# Altium schematic sheet P[06]_LPDDR4.SchDoc
size 513 x 386 mm
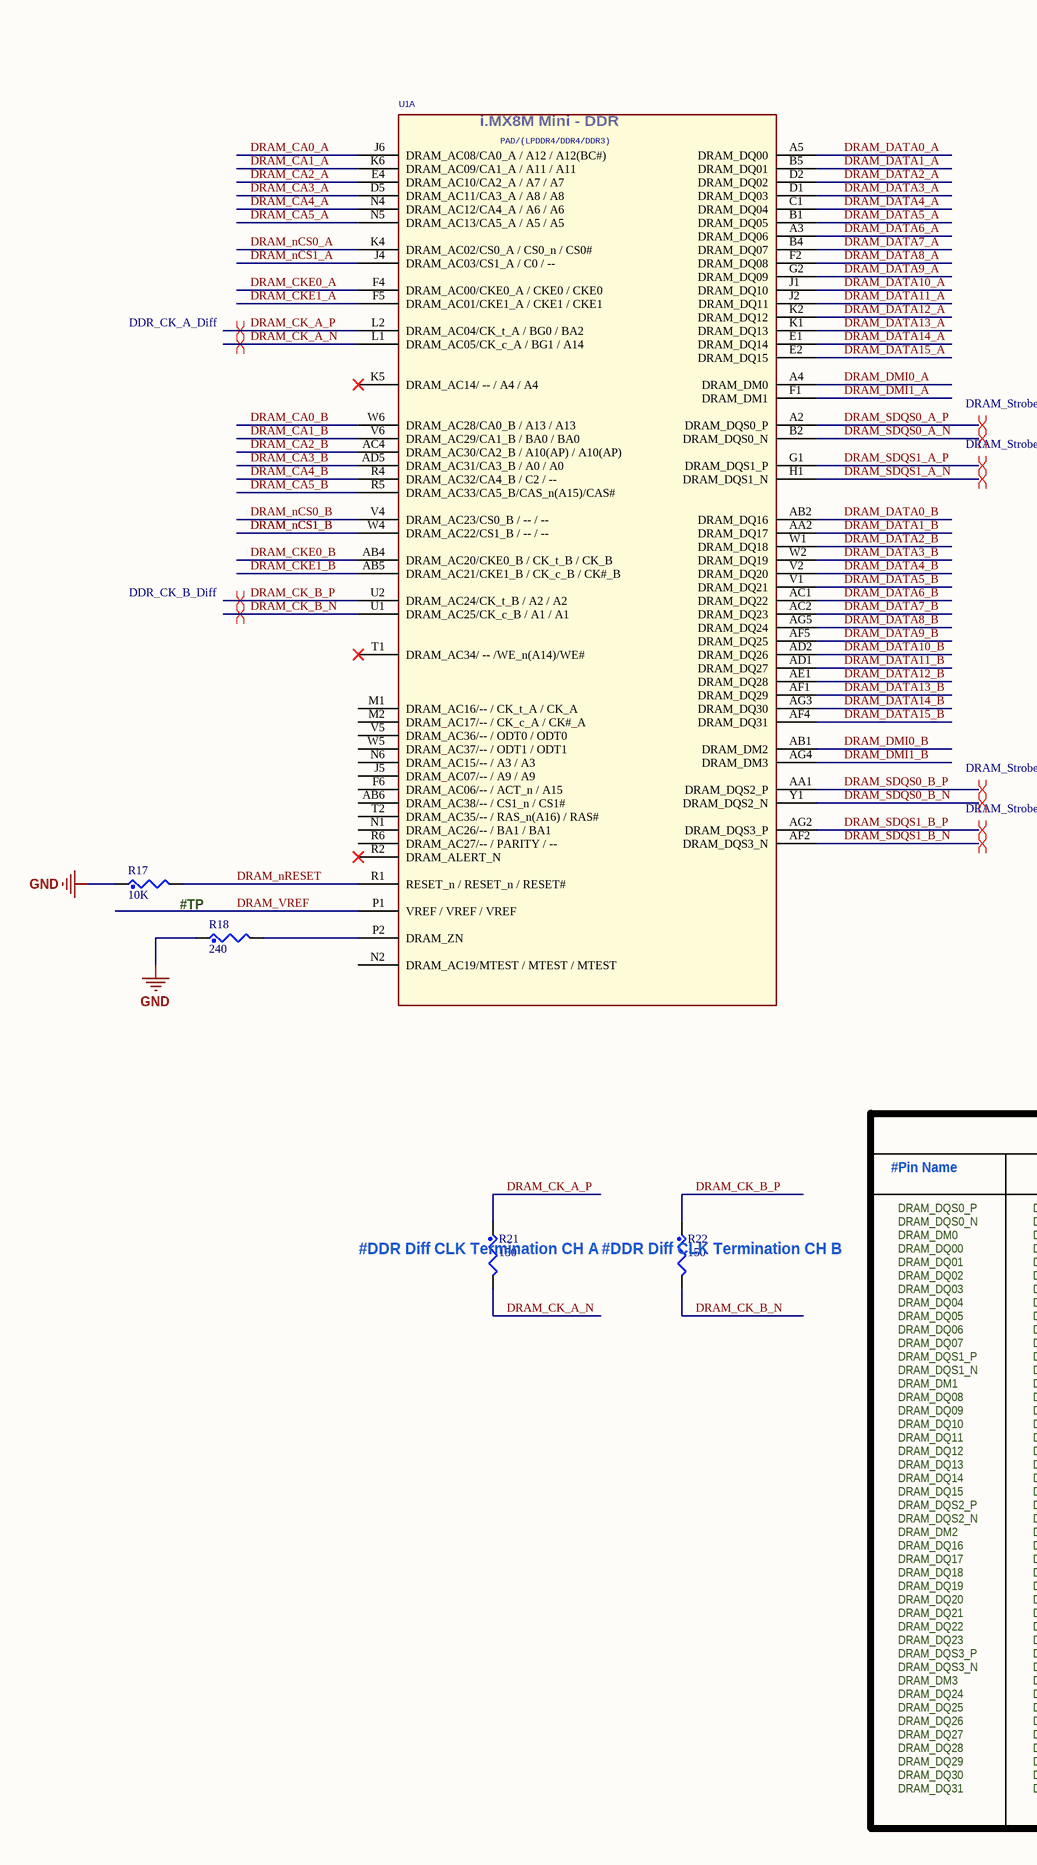
[diagram p0: P[06]_LPDDR4.SchDoc, left]
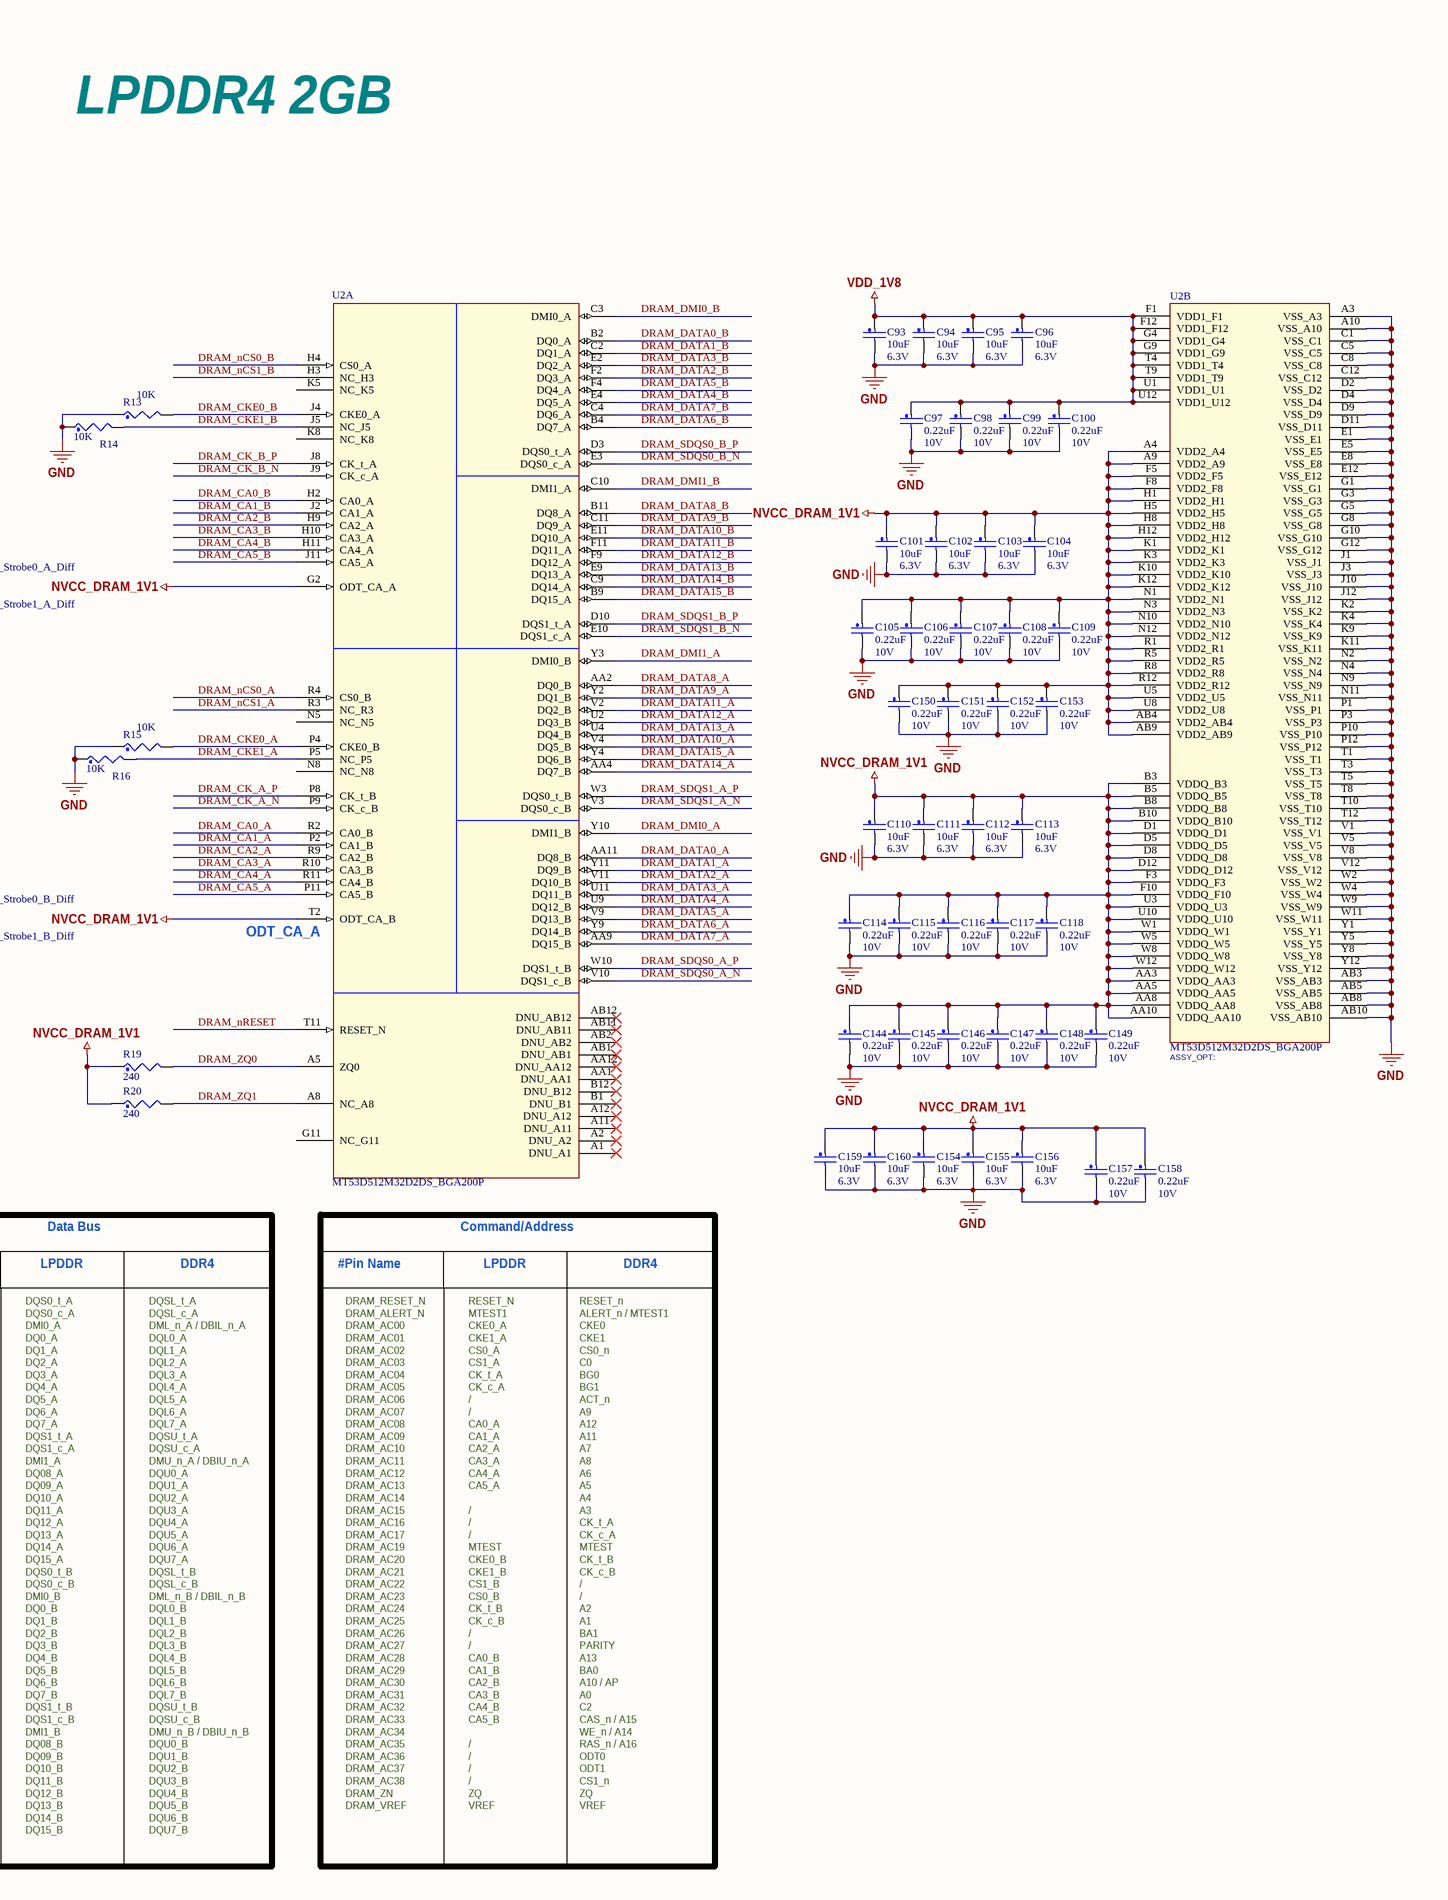
[diagram p1: P[06]_LPDDR4.SchDoc, right]

## Parts
C93  10uF  Voltage: 6.3V  [0402_CC - C]
C94  10uF  Voltage: 6.3V  [0402_CC - C]
C95  10uF  Voltage: 6.3V  [0402_CC - C]
C96  10uF  Voltage: 6.3V  [0402_CC - C]
C97  0.22uF  Voltage: 10V  [0201_CC - C]
C98  0.22uF  Voltage: 10V  [0201_CC - C]
C99  0.22uF  Voltage: 10V  [0201_CC - C]
C100  0.22uF  Voltage: 10V  [0201_CC - C]
C101  10uF  Voltage: 6.3V  [0402_CC - C]
C102  10uF  Voltage: 6.3V  [0402_CC - C]
C103  10uF  Voltage: 6.3V  [0402_CC - C]
C104  10uF  Voltage: 6.3V  [0402_CC - C]
C105  0.22uF  Voltage: 10V  [0201_CC - C]
C106  0.22uF  Voltage: 10V  [0201_CC - C]
C107  0.22uF  Voltage: 10V  [0201_CC - C]
C108  0.22uF  Voltage: 10V  [0201_CC - C]
C109  0.22uF  Voltage: 10V  [0201_CC - C]
C110  10uF  Voltage: 6.3V  [0402_CC - C]
C111  10uF  Voltage: 6.3V  [0402_CC - C]
C112  10uF  Voltage: 6.3V  [0402_CC - C]
C113  10uF  Voltage: 6.3V  [0402_CC - C]
C114  0.22uF  Voltage: 10V  [0201_CC - C]
C115  0.22uF  Voltage: 10V  [0201_CC - C]
C116  0.22uF  Voltage: 10V  [0201_CC - C]
C117  0.22uF  Voltage: 10V  [0201_CC - C]
C118  0.22uF  Voltage: 10V  [0201_CC - C]
C144  0.22uF  Voltage: 10V  [0201_CC - C]
C145  0.22uF  Voltage: 10V  [0201_CC - C]
C146  0.22uF  Voltage: 10V  [0201_CC - C]
C147  0.22uF  Voltage: 10V  [0201_CC - C]
C148  0.22uF  Voltage: 10V  [0201_CC - C]
C149  0.22uF  Voltage: 10V  [0201_CC - C]
C150  0.22uF  Voltage: 10V  [0201_CC - C]
C151  0.22uF  Voltage: 10V  [0201_CC - C]
C152  0.22uF  Voltage: 10V  [0201_CC - C]
C153  0.22uF  Voltage: 10V  [0201_CC - C]
C154  10uF  Voltage: 6.3V  [0402_CC - C]
C155  10uF  Voltage: 6.3V  [0402_CC - C]
C156  10uF  Voltage: 6.3V  [0402_CC - C]
C157  0.22uF  Voltage: 10V  [0201_CC - C]
C158  0.22uF  Voltage: 10V  [0201_CC - C]
C159  10uF  Voltage: 6.3V  [0402_CC - C]
C160  10uF  Voltage: 6.3V  [0402_CC - C]
R13  10K  [0201_CC]
R14  10K  [0201_CC]
R15  10K  [0201_CC]
R16  10K  [0201_CC]
R17  10K  [0201_CC]
R18  240  [0201_CC]
R19  240  [0201_CC]
R20  240  [0201_CC]
R21  150  [0402_CC]
R22  150  [0402_CC]
U1  (no value)  [BGA486_0P5_14X14]  (part A of 14)
U2  MT53D512M32D2DS_BGA200P  [BGA200_0P65X0P8_10P1X14P6]  (parts A,B of 2)

## Nets
GND: C93.2 C94.2 C95.2 C96.2 C97.2 C98.2 C99.2 C100.2 C101.2 C102.2 C103.2 C104.2 C105.2 C106.2 C107.2 C108.2 C109.2 C110.2 C111.2 C112.2 C113.2 C114.2 C115.2 C116.2 C117.2 C118.2 C144.2 C145.2 C146.2 C147.2 C148.2 C149.2 C150.2 C151.2 C152.2 C153.2 C154.2 C155.2 C156.2 C157.2 C158.2 C159.2 C160.2 R13.1 R14.1 R15.1 R16.1 R17.1 R18.1 U2.A3(VSS_A3) U2.A10(VSS_A10) U2.AB3(VSS_AB3) U2.AB5(VSS_AB5) U2.AB8(VSS_AB8) U2.AB10(VSS_AB10) U2.C1(VSS_C1) U2.C5(VSS_C5) U2.C8(VSS_C8) U2.C12(VSS_C12) U2.D2(VSS_D2) U2.D4(VSS_D4) U2.D9(VSS_D9) U2.D11(VSS_D11) U2.E1(VSS_E1) U2.E5(VSS_E5) U2.E8(VSS_E8) U2.E12(VSS_E12) U2.G1(VSS_G1) U2.G3(VSS_G3) U2.G5(VSS_G5) U2.G8(VSS_G8) U2.G10(VSS_G10) U2.G12(VSS_G12) U2.J1(VSS_J1) U2.J3(VSS_J3) U2.J10(VSS_J10) U2.J12(VSS_J12) U2.K2(VSS_K2) U2.K4(VSS_K4) U2.K9(VSS_K9) U2.K11(VSS_K11) U2.N2(VSS_N2) U2.N4(VSS_N4) U2.N9(VSS_N9) U2.N11(VSS_N11) U2.P1(VSS_P1) U2.P3(VSS_P3) U2.P10(VSS_P10) U2.P12(VSS_P12) U2.T1(VSS_T1) U2.T3(VSS_T3) U2.T5(VSS_T5) U2.T8(VSS_T8) U2.T10(VSS_T10) U2.T12(VSS_T12) U2.V1(VSS_V1) U2.V5(VSS_V5) U2.V8(VSS_V8) U2.V12(VSS_V12) U2.W2(VSS_W2) U2.W4(VSS_W4) U2.W9(VSS_W9) U2.W11(VSS_W11) U2.Y1(VSS_Y1) U2.Y5(VSS_Y5) U2.Y8(VSS_Y8) U2.Y12(VSS_Y12)
NVCC_DRAM_1V1: C101.1 C102.1 C103.1 C104.1 C105.1 C106.1 C107.1 C108.1 C109.1 C110.1 C111.1 C112.1 C113.1 C114.1 C115.1 C116.1 C117.1 C118.1 C144.1 C145.1 C146.1 C147.1 C148.1 C149.1 C150.1 C151.1 C152.1 C153.1 C154.1 C155.1 C156.1 C157.1 C158.1 C159.1 C160.1 R19.1 R20.1 U2.A4(VDD2_A4) U2.A9(VDD2_A9) U2.AA3(VDDQ_AA3) U2.AA5(VDDQ_AA5) U2.AA8(VDDQ_AA8) U2.AA10(VDDQ_AA10) U2.AB4(VDD2_AB4) U2.AB9(VDD2_AB9) U2.B3(VDDQ_B3) U2.B5(VDDQ_B5) U2.B8(VDDQ_B8) U2.B10(VDDQ_B10) U2.D1(VDDQ_D1) U2.D5(VDDQ_D5) U2.D8(VDDQ_D8) U2.D12(VDDQ_D12) U2.F3(VDDQ_F3) U2.F5(VDD2_F5) U2.F8(VDD2_F8) U2.F10(VDDQ_F10) U2.G2(ODT_CA_A) U2.H1(VDD2_H1) U2.H5(VDD2_H5) U2.H8(VDD2_H8) U2.H12(VDD2_H12) U2.K1(VDD2_K1) U2.K3(VDD2_K3) U2.K10(VDD2_K10) U2.K12(VDD2_K12) U2.N1(VDD2_N1) U2.N3(VDD2_N3) U2.N10(VDD2_N10) U2.N12(VDD2_N12) U2.R1(VDD2_R1) U2.R5(VDD2_R5) U2.R8(VDD2_R8) U2.R12(VDD2_R12) U2.T2(ODT_CA_B) U2.U3(VDDQ_U3) U2.U5(VDD2_U5) U2.U8(VDD2_U8) U2.U10(VDDQ_U10) U2.W1(VDDQ_W1) U2.W5(VDDQ_W5) U2.W8(VDDQ_W8) U2.W12(VDDQ_W12)
VDD_1V8: C93.1 C94.1 C95.1 C96.1 C97.1 C98.1 C99.1 C100.1 U2.F1(VDD1_F1) U2.F12(VDD1_F12) U2.G4(VDD1_G4) U2.G9(VDD1_G9) U2.T4(VDD1_T4) U2.T9(VDD1_T9) U2.U1(VDD1_U1) U2.U12(VDD1_U12)
DRAM_CA0_A: U1.J6(DRAM_AC08/CA0_A_/_A12_/_A12(BC#)) U2.R2(CA0_B)
DRAM_CA0_B: U1.W6(DRAM_AC28/CA0_B_/_A13_/_A13) U2.H2(CA0_A)
DRAM_CA1_A: U1.K6(DRAM_AC09/CA1_A_/_A11_/_A11) U2.P2(CA1_B)
DRAM_CA1_B: U1.V6(DRAM_AC29/CA1_B_/_BA0_/_BA0) U2.J2(CA1_A)
DRAM_CA2_A: U1.E4(DRAM_AC10/CA2_A_/_A7_/_A7) U2.R9(CA2_B)
DRAM_CA2_B: U1.AC4(DRAM_AC30/CA2_B_/_A10(AP)_/_A10(AP)) U2.H9(CA2_A)
DRAM_CA3_A: U1.D5(DRAM_AC11/CA3_A_/_A8_/_A8) U2.R10(CA3_B)
DRAM_CA3_B: U1.AD5(DRAM_AC31/CA3_B_/_A0_/_A0) U2.H10(CA3_A)
DRAM_CA4_A: U1.N4(DRAM_AC12/CA4_A_/_A6_/_A6) U2.R11(CA4_B)
DRAM_CA4_B: U1.R4(DRAM_AC32/CA4_B_/_C2_/_--) U2.H11(CA4_A)
DRAM_CA5_A: U1.N5(DRAM_AC13/CA5_A_/_A5_/_A5) U2.P11(CA5_B)
DRAM_CA5_B: U1.R5(DRAM_AC33/CA5_B/CAS_n(A15)/CAS#) U2.J11(CA5_A)
DRAM_CK_A_N: R21.2 U1.L1(DRAM_AC05/CK_c_A_/_BG1_/_A14) U2.P9(CK_c_B)
DRAM_CK_A_P: R21.1 U1.L2(DRAM_AC04/CK_t_A_/_BG0_/_BA2) U2.P8(CK_t_B)
DRAM_CK_B_N: R22.2 U1.U1(DRAM_AC25/CK_c_B_/_A1_/_A1) U2.J9(CK_c_A)
DRAM_CK_B_P: R22.1 U1.U2(DRAM_AC24/CK_t_B_/_A2_/_A2) U2.J8(CK_t_A)
DRAM_CKE0_A: R15.2 U1.F4(DRAM_AC00/CKE0_A_/_CKE0_/_CKE0) U2.P4(CKE0_B)
DRAM_CKE0_B: R13.2 U1.AB4(DRAM_AC20/CKE0_B_/_CK_t_B_/_CK_B) U2.J4(CKE0_A)
DRAM_CKE1_A: R16.2 U1.F5(DRAM_AC01/CKE1_A_/_CKE1_/_CKE1) U2.P5(NC_P5)
DRAM_CKE1_B: R14.2 U1.AB5(DRAM_AC21/CKE1_B_/_CK_c_B_/_CK#_B) U2.J5(NC_J5)
DRAM_DATA0_A: U1.A5(DRAM_DQ00) U2.AA11(DQ8_B)
DRAM_DATA0_B: U1.AB2(DRAM_DQ16) U2.B2(DQ0_A)
DRAM_DATA1_A: U1.B5(DRAM_DQ01) U2.Y11(DQ9_B)
DRAM_DATA1_B: U1.AA2(DRAM_DQ17) U2.C2(DQ1_A)
DRAM_DATA2_A: U1.D2(DRAM_DQ02) U2.V11(DQ10_B)
DRAM_DATA2_B: U1.W1(DRAM_DQ18) U2.F2(DQ3_A)
DRAM_DATA3_A: U1.D1(DRAM_DQ03) U2.U11(DQ11_B)
DRAM_DATA3_B: U1.W2(DRAM_DQ19) U2.E2(DQ2_A)
DRAM_DATA4_A: U1.C1(DRAM_DQ04) U2.U9(DQ12_B)
DRAM_DATA4_B: U1.V2(DRAM_DQ20) U2.E4(DQ5_A)
DRAM_DATA5_A: U1.B1(DRAM_DQ05) U2.V9(DQ13_B)
DRAM_DATA5_B: U1.V1(DRAM_DQ21) U2.F4(DQ4_A)
DRAM_DATA6_A: U1.A3(DRAM_DQ06) U2.Y9(DQ14_B)
DRAM_DATA6_B: U1.AC1(DRAM_DQ22) U2.B4(DQ7_A)
DRAM_DATA7_A: U1.B4(DRAM_DQ07) U2.AA9(DQ15_B)
DRAM_DATA7_B: U1.AC2(DRAM_DQ23) U2.C4(DQ6_A)
DRAM_DATA8_A: U1.F2(DRAM_DQ08) U2.AA2(DQ0_B)
DRAM_DATA8_B: U1.AG5(DRAM_DQ24) U2.B11(DQ8_A)
DRAM_DATA9_A: U1.G2(DRAM_DQ09) U2.Y2(DQ1_B)
DRAM_DATA9_B: U1.AF5(DRAM_DQ25) U2.C11(DQ9_A)
DRAM_DATA10_A: U1.J1(DRAM_DQ10) U2.V4(DQ5_B)
DRAM_DATA10_B: U1.AD2(DRAM_DQ26) U2.E11(DQ10_A)
DRAM_DATA11_A: U1.J2(DRAM_DQ11) U2.V2(DQ2_B)
DRAM_DATA11_B: U1.AD1(DRAM_DQ27) U2.F11(DQ11_A)
DRAM_DATA12_A: U1.K2(DRAM_DQ12) U2.U2(DQ3_B)
DRAM_DATA12_B: U1.AE1(DRAM_DQ28) U2.F9(DQ12_A)
DRAM_DATA13_A: U1.K1(DRAM_DQ13) U2.U4(DQ4_B)
DRAM_DATA13_B: U1.AF1(DRAM_DQ29) U2.E9(DQ13_A)
DRAM_DATA14_A: U1.E1(DRAM_DQ14) U2.AA4(DQ7_B)
DRAM_DATA14_B: U1.AG3(DRAM_DQ30) U2.C9(DQ14_A)
DRAM_DATA15_A: U1.E2(DRAM_DQ15) U2.Y4(DQ6_B)
DRAM_DATA15_B: U1.AF4(DRAM_DQ31) U2.B9(DQ15_A)
DRAM_DMI0_A: U1.A4(DRAM_DM0) U2.Y10(DMI1_B)
DRAM_DMI0_B: U1.AB1(DRAM_DM2) U2.C3(DMI0_A)
DRAM_DMI1_A: U1.F1(DRAM_DM1) U2.Y3(DMI0_B)
DRAM_DMI1_B: U1.AG4(DRAM_DM3) U2.C10(DMI1_A)
DRAM_nCS0_A: U1.K4(DRAM_AC02/CS0_A_/_CS0_n_/_CS0#) U2.R4(CS0_B)
DRAM_nCS0_B: U1.V4(DRAM_AC23/CS0_B_/_--_/_--) U2.H4(CS0_A)
DRAM_nCS1_A: U1.J4(DRAM_AC03/CS1_A_/_C0_/_--) U2.R3(NC_R3)
DRAM_nCS1_B: U1.W4(DRAM_AC22/CS1_B_/_--_/_--) U2.H3(NC_H3)
DRAM_nRESET: R17.2 U1.R1(RESET_n_/_RESET_n_/_RESET#) U2.T11(RESET_N)
DRAM_SDQS0_A_N: U1.B2(DRAM_DQS0_N) U2.V10(DQS1_c_B)
DRAM_SDQS0_A_P: U1.A2(DRAM_DQS0_P) U2.W10(DQS1_t_B)
DRAM_SDQS0_B_N: U1.Y1(DRAM_DQS2_N) U2.E3(DQS0_c_A)
DRAM_SDQS0_B_P: U1.AA1(DRAM_DQS2_P) U2.D3(DQS0_t_A)
DRAM_SDQS1_A_N: U1.H1(DRAM_DQS1_N) U2.V3(DQS0_c_B)
DRAM_SDQS1_A_P: U1.G1(DRAM_DQS1_P) U2.W3(DQS0_t_B)
DRAM_SDQS1_B_N: U1.AF2(DRAM_DQS3_N) U2.E10(DQS1_c_A)
DRAM_SDQS1_B_P: U1.AG2(DRAM_DQS3_P) U2.D10(DQS1_t_A)
DRAM_VREF: U1.P1(VREF_/_VREF_/_VREF)
DRAM_ZQ0: R19.2 U2.A5(ZQ0)
DRAM_ZQ1: R20.2 U2.A8(NC_A8)
NetR18_2: R18.2 U1.P2(DRAM_ZN)

Not connected (* = marked no-connect by the designer): U1 AB6(DRAM_AC38/--_/_CS1_n_/_CS1#) F6(DRAM_AC06/--_/_ACT_n_/_A15) J5(DRAM_AC07/--_/_A9_/_A9) K5(DRAM_AC14/_--_/_A4_/_A4)* M1(DRAM_AC16/--_/_CK_t_A_/_CK_A) M2(DRAM_AC17/--_/_CK_c_A_/_CK#_A) N1(DRAM_AC26/--_/_BA1_/_BA1) N2(DRAM_AC19/MTEST_/_MTEST_/_MTEST) N6(DRAM_AC15/--_/_A3_/_A3) R2(DRAM_ALERT_N)* R6(DRAM_AC27/--_/_PARITY_/_--) T1(DRAM_AC34/_--_/WE_n(A14)/WE#)* T2(DRAM_AC35/--_/_RAS_n(A16)_/_RAS#) V5(DRAM_AC36/--_/_ODT0_/_ODT0) W5(DRAM_AC37/--_/_ODT1_/_ODT1); U2 A1(DNU_A1)* A2(DNU_A2)* A11(DNU_A11)* A12(DNU_A12)* AA1(DNU_AA1)* AA12(DNU_AA12)* AB1(DNU_AB1)* AB2(DNU_AB2)* AB11(DNU_AB11)* AB12(DNU_AB12)* B1(DNU_B1)* B12(DNU_B12)* G11(NC_G11) K5(NC_K5) K8(NC_K8) N5(NC_N5) N8(NC_N8)

## Layout directives
differential pair; differential pair class DRAM_Strobe0_A_Diff: DRAM_SDQS0_A_P
differential pair: DRAM_CK_A_N, DRAM_CK_B_N, DRAM_SDQS0_A_N, DRAM_SDQS0_B_N, DRAM_SDQS1_A_N, DRAM_SDQS1_B_N
differential pair; differential pair class DRAM_Strobe1_A_Diff: DRAM_SDQS1_A_P
differential pair; differential pair class DRAM_Strobe0_B_Diff: DRAM_SDQS0_B_P
differential pair; differential pair class DRAM_Strobe1_B_Diff: DRAM_SDQS1_B_P
differential pair; differential pair class DDR_CK_B_Diff: DRAM_CK_B_P
differential pair; differential pair class DDR_CK_A_Diff: DRAM_CK_A_P

## Notes on the sheet
- LPDDR4 2GB
- (near U2) ODT_CA_A
- #TP
- Data Bus
- Command/Address
- #Pin Name
- LPDDR
- DDR4
- (near R21) #DDR Diff CLK Termination CH A
- (near R22) #DDR Diff CLK Termination CH B
- DRAM_DQS0_P
  DRAM_DQS0_N
  DRAM_DM0
  DRAM_DQ00
  DRAM_DQ01
  DRAM_DQ02
  DRAM_DQ03
  DRAM_DQ04
  DRAM_DQ05
  DRAM_DQ06
  DRAM_DQ07
  DRAM_DQS1_P
  DRAM_DQS1_N
  DRAM_DM1
  DRAM_DQ08
  DRAM_DQ09
  DRAM_DQ10
  DRAM_DQ11
  DRAM_DQ12
  DRAM_DQ13
  DRAM_DQ14
  DRAM_DQ15
  DRAM_DQS2_P
  DRAM_DQS2_N
  DRAM_DM2
  DRAM_DQ16
  DRAM_DQ17
  DRAM_DQ18
  DRAM_DQ19
  DRAM_DQ20
  DRAM_DQ21
  DRAM_DQ22
  DRAM_DQ23
  DRAM_DQS3_P
  DRAM_DQS3_N
  DRAM_DM3
  DRAM_DQ24
  DRAM_DQ25
  DRAM_DQ26
  DRAM_DQ27
  DRAM_DQ28
  DRAM_DQ29
  DRAM_DQ30
  DRAM_DQ31
- DQS0_t_A
  DQS0_c_A
  DMI0_A
  DQ0_A
  DQ1_A
  DQ2_A
  DQ3_A
  DQ4_A
  DQ5_A
  DQ6_A
  DQ7_A
  DQS1_t_A
  DQS1_c_A
  DMI1_A
  DQ08_A
  DQ09_A
  DQ10_A
  DQ11_A
  DQ12_A
  DQ13_A
  DQ14_A
  DQ15_A
  DQS0_t_B
  DQS0_c_B
  DMI0_B
  DQ0_B
  DQ1_B
  DQ2_B
  DQ3_B
  DQ4_B
  DQ5_B
  DQ6_B
  DQ7_B
  DQS1_t_B
  DQS1_c_B
  DMI1_B
  DQ08_B
  DQ09_B
  DQ10_B
  DQ11_B
  DQ12_B
  DQ13_B
  DQ14_B
  DQ15_B
- DQSL_t_A
  DQSL_c_A
  DML_n_A / DBIL_n_A
  DQL0_A
  DQL1_A
  DQL2_A
  DQL3_A
  DQL4_A
  DQL5_A
  DQL6_A
  DQL7_A
  DQSU_t_A
  DQSU_c_A
  DMU_n_A / DBIU_n_A
  DQU0_A
  DQU1_A
  DQU2_A
  DQU3_A
  DQU4_A
  DQU5_A
  DQU6_A
  DQU7_A
  DQSL_t_B
  DQSL_c_B
  DML_n_B / DBIL_n_B
  DQL0_B
  DQL1_B
  DQL2_B
  DQL3_B
  DQL4_B
  DQL5_B
  DQL6_B
  DQL7_B
  DQSU_t_B
  DQSU_c_B
  DMU_n_B / DBIU_n_B
  DQU0_B
  DQU1_B
  DQU2_B
  DQU3_B
  DQU4_B
  DQU5_B
  DQU6_B
  DQU7_B
- DRAM_RESET_N
  DRAM_ALERT_N
  DRAM_AC00
  DRAM_AC01
  DRAM_AC02
  DRAM_AC03
  DRAM_AC04
  DRAM_AC05
  DRAM_AC06
  DRAM_AC07
  DRAM_AC08
  DRAM_AC09
  DRAM_AC10
  DRAM_AC11
  DRAM_AC12
  DRAM_AC13
  DRAM_AC14
  DRAM_AC15
  DRAM_AC16
  DRAM_AC17
  DRAM_AC19
  DRAM_AC20
  DRAM_AC21
  DRAM_AC22
  DRAM_AC23
  DRAM_AC24
  DRAM_AC25
  DRAM_AC26
  DRAM_AC27
  DRAM_AC28
  DRAM_AC29
  DRAM_AC30
  DRAM_AC31
  DRAM_AC32
  DRAM_AC33
  DRAM_AC34
  DRAM_AC35
  DRAM_AC36
  DRAM_AC37
  DRAM_AC38
  DRAM_ZN
  DRAM_VREF
- RESET_N
  MTEST1
  CKE0_A
  CKE1_A
  CS0_A
  CS1_A
  CK_t_A
  CK_c_A
  /
  /
  CA0_A
  CA1_A
  CA2_A
  CA3_A
  CA4_A
  CA5_A
  /
  /
  /
  MTEST
  CKE0_B
  CKE1_B
  CS1_B
  CS0_B
  CK_t_B
  CK_c_B
  /
  /
  CA0_B
  CA1_B
  CA2_B
  CA3_B
  CA4_B
  CA5_B
  /
  /
  /
  /
  ZQ
  VREF
- RESET_n
  ALERT_n / MTEST1
  CKE0
  CKE1
  CS0_n
  C0
  BG0
  BG1
  ACT_n
  A9
  A12
  A11
  A7
  A8
  A6
  A5
  A4
  A3
  CK_t_A
  CK_c_A
  MTEST
  CK_t_B
  CK_c_B
  /
  /
  A2
  A1
  BA1
  PARITY
  A13
  BA0
  A10 / AP
  A0
  C2
  CAS_n / A15
  WE_n / A14
  RAS_n / A16
  ODT0
  ODT1
  CS1_n
  ZQ
  VREF
- (in symbol MIMX8MM_BGA486P, part A) i.MX8M Mini - DDR; PAD/(LPDDR4/DDR4/DDR3)

## Library data of the parts
C93-C118 C144-C160 = CAP_NP: CLASS: DISCRETE
R13-R22 = RES: CLASS: DISCRETE
U1 = MIMX8MM_BGA486P: IC CPU QUAD CORTEX A53+M4 1.8GHZ BGA486 / By Arman Arvand; SPLIT_INST: TRUE; CAD_APPROVED: Yes; PRE_APN: 330-77072; MFG_PN01: MIMX8MM6DVTLZAA; MFG_NAME01: NXP SEMICONDUCTORS; AGILE_PN: TMP-WF-32905; CLASS: IC; HEIGHT: 1.25MM; ROHS: Yes
U2 = MT53D512M32D2DS_BGA200P: MT53D512M32D2DS_BGA200P\By AAR; SWAP_INFO: (S1+S2); SPLIT_INST: TRUE; CLASS: IC